# EAGLE design RTDS (EAGLE 9.4.0)
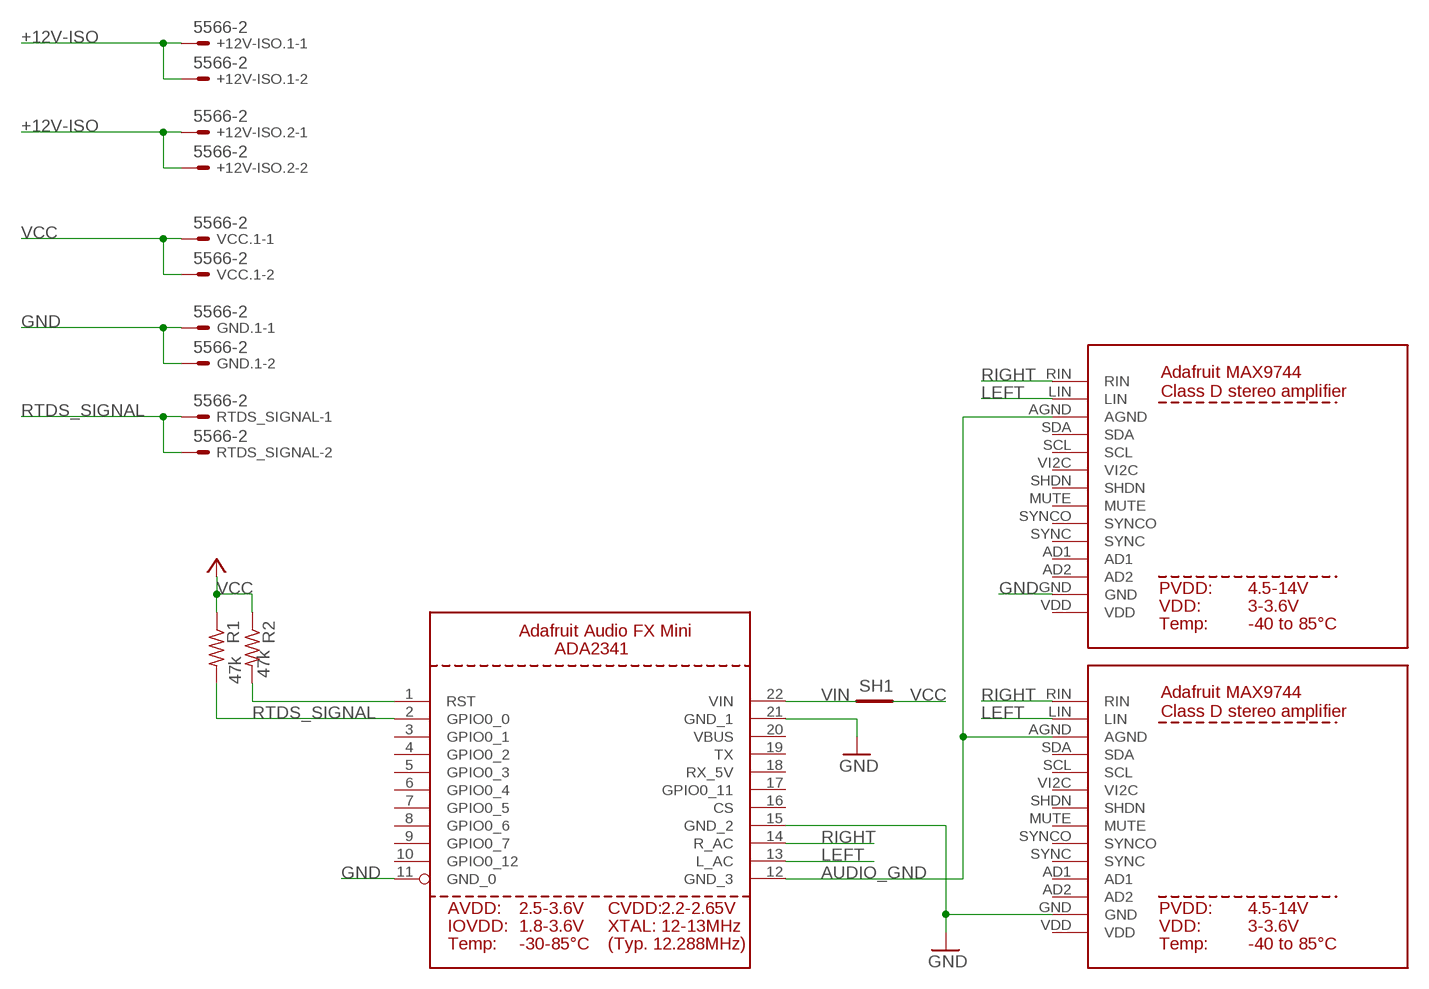
[diagram p0: schematic, sheet 1]

## Parts
+12V-ISO.1  5566-2  [5566-2]
+12V-ISO.2  5566-2  [5566-2]
GND.1  5566-2  [5566-2]
R1  47k  R-US_R0805  [R0805]
R2  47k  R-US_R0805  [R0805]
RTDS_SIGNAL  5566-2  [5566-2]
SH1  SHORTT5  [SHORT_TOP-50]
U$1  MAX9744  [MAX9744]
U$2  ADA-SOUNDFX  [ADA-SOUNDFX]
U$3  MAX9744  [MAX9744]
VCC.1  5566-2  [5566-2]

## Nets
+12V-ISO: +12V-ISO.1.1 +12V-ISO.1.2 +12V-ISO.2.1 +12V-ISO.2.2
AUDIO_GND: U$1.AGND U$2.12(GND_3) U$3.AGND
GND: GND.1.1 GND.1.2 U$1.GND U$2.11(GND_0) U$2.15(GND_2) U$2.21(GND_1) U$3.GND
LEFT: U$1.LIN U$2.13(L_AC) U$3.LIN
RESET_SIGNAL: R2.2 U$2.1(RST)
RIGHT: U$1.RIN U$2.14(R_AC) U$3.RIN
RTDS_SIGNAL: R1.2 RTDS_SIGNAL.1 RTDS_SIGNAL.2 U$2.2(GPIO0_0)
VCC: R1.1 R2.1 SH1.2 VCC.1.1 VCC.1.2
VIN: SH1.1 U$2.22(VIN)
Unconnected: U$1.AD1 U$1.AD2 U$1.MUTE U$1.SCL U$1.SDA U$1.SHDN U$1.SYNC U$1.SYNCO U$1.VDD U$1.VI2C U$2.3(GPIO0_1) U$2.4(GPIO0_2) U$2.5(GPIO0_3) U$2.6(GPIO0_4) U$2.7(GPIO0_5) U$2.8(GPIO0_6) U$2.9(GPIO0_7) U$2.10(GPIO0_12) U$2.16(CS) U$2.17(GPIO0_11) U$2.18(RX_5V) U$2.19(TX) U$2.20(VBUS) U$3.AD1 U$3.AD2 U$3.MUTE U$3.SCL U$3.SDA U$3.SHDN U$3.SYNC U$3.SYNCO U$3.VDD U$3.VI2C

## Library data of the parts
+12V-ISO.1 +12V-ISO.2 GND.1 RTDS_SIGNAL VCC.1 = con-molex:5566-2: Mini FIT connector 2 pol Source: http://www.molex.com; MF: MOLEX; OC_FARNELL: 1822072; OC_NEWARK: unknown
R1 R2 = rcl:R-US_: RESISTOR, American symbol; SPICEPREFIX: R
SH1 = shorts:SHORT: Short between two nets; BOM: no
U$1 U$3 = IowaFormula:MAX9744
U$2 = IowaFormula:ADA-SOUNDFX

## Board
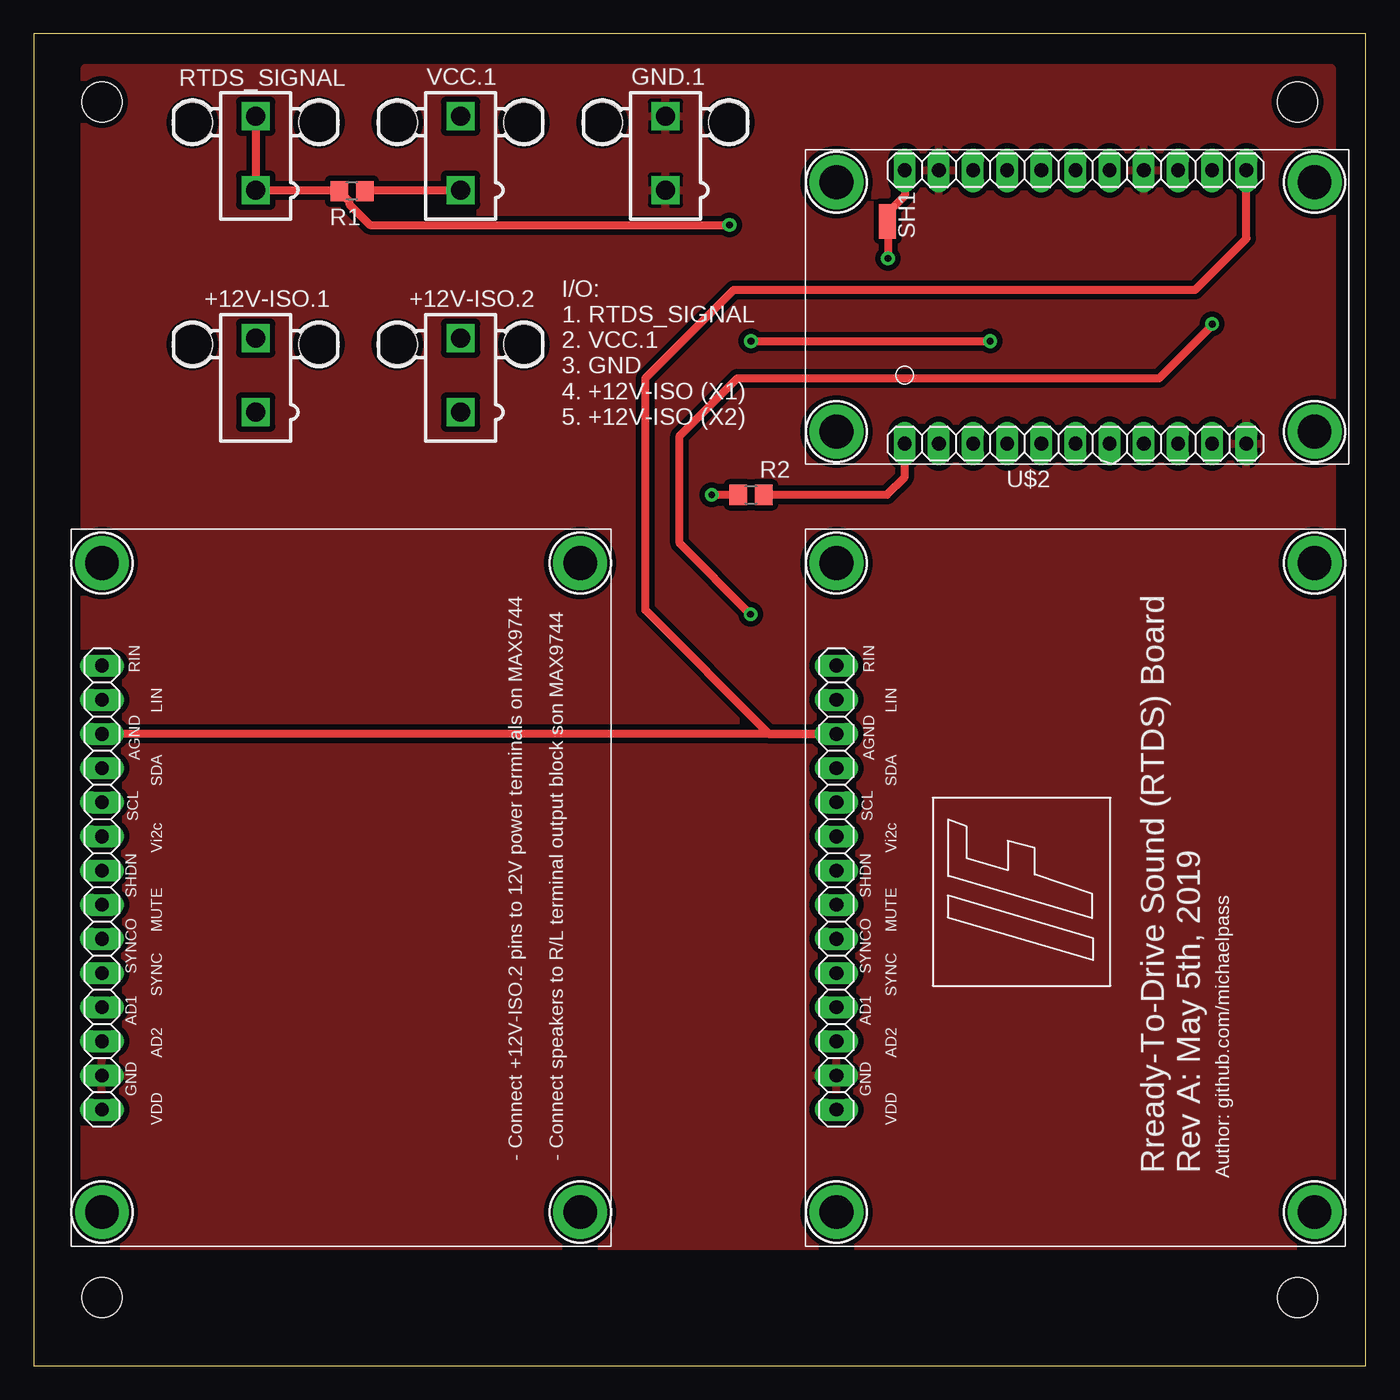
[diagram p1: board, top side]
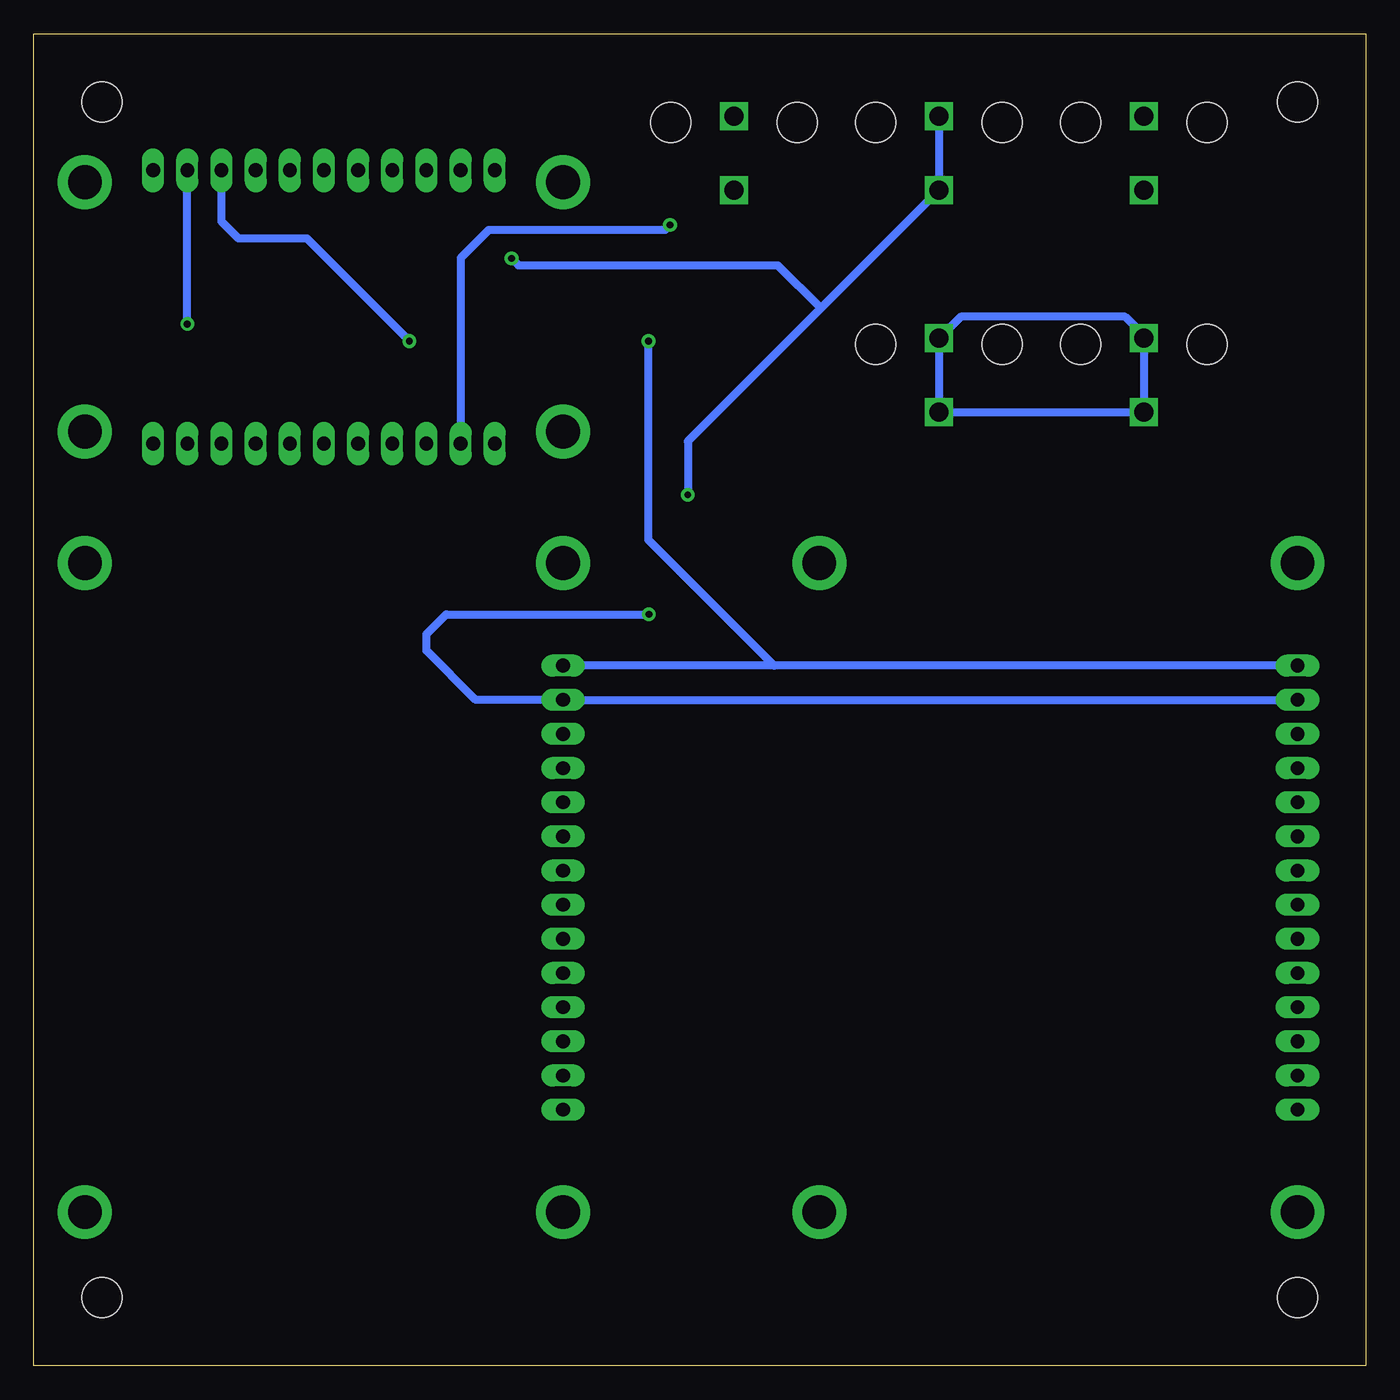
[diagram p2: board, bottom side, seen from below]

Size 99.06 x 99.06 mm. Coordinates in mm from the lower left corner, seen from the top.
Outline: 0,0 99.06,0 99.06,99.06 0,99.06 0,0
Copper layers (1*16): Top 0.035mm / dielectric 1.5mm / Bottom 0.035mm
Design rules "default *": minimum track width 8mil, minimum drill 20mil, track to track 8mil, track to pad 8mil, pad to pad 8mil, via to via 8mil, smd to smd 8mil, copper to edge 10mil, drill to drill 8mil, minimum pad ring 12mil, minimum via ring 10mil, stop-mask expansion 4mil, vias tented up to drill 25mil, thermal gap 10mil
Holes 3 mm at 5.08,5.08 93.98,5.08 5.08,93.98 93.98,93.98

### Footprints (pad centres in the part's own frame; a part is rotated, then mirrored left to right if it is on the bottom)
5566-2 = drill 1.4 square: 1 0,-2.75; 2 0,2.75 | hole 3: 4.7,2.29; -4.7,2.29
R0805 = smd 1.3 x 1.5: 1 -0.95,0; 2 0.95,0
SHORT_TOP-50 = smd 1.27 x 1.27: 1 0.635,0; 2 -0.635,0
MAX9744 = drill 1.016 long: AD1 33.02,0; AD2 35.56,0; AGND 12.7,0; GND 38.1,0; LIN 10.16,0; MUTE 25.4,0; RIN 7.62,0; SCL 17.78,0; SDA 15.24,0; SHDN 22.86,0; SYNC 30.48,0; SYNCO 27.94,0; VDD 40.64,0; VI2C 20.32,0 | drill 2.5 pad 4: P$1 0,0; P$2 48.26,0; P$3 0,35.56; P$4 48.26,35.56
ADA-SOUNDFX = drill 1.016 long: 1 0,25.4; 2 0,22.86; 3 0,20.32; 4 0,17.78; 5 0,15.24; 6 0,12.7; 7 0,10.16; 8 0,7.62; 9 0,5.08; 10 0,2.54; 11 0,0; 12 20.32,0; 13 20.32,2.54; 14 20.32,5.08; 15 20.32,7.62; 16 20.32,10.16; 17 20.32,12.7; 18 20.32,15.24; 19 20.32,17.78; 20 20.32,20.32; 21 20.32,22.86; 22 20.32,25.4 | drill 2.5 pad 4: P$1 0.889,30.48; P$2 19.431,30.48; P$3 0.889,-5.08; P$4 19.431,-5.08

### Placement (x,y rotation side)
+12V-ISO.1  16.51,73.66 0 top
+12V-ISO.2  31.75,73.66 0 top
GND.1  46.99,90.17 0 top
R1  23.67,87.35 180 top
R2  53.34,64.77 0 top
RTDS_SIGNAL  16.51,90.17 0 top
SH1  63.5,85.09 90 top
U$1  59.69,59.69 270 top
U$2  90.17,68.58 90 top
U$3  5.08,59.69 270 top
VCC.1  31.75,90.17 0 top

### Tracks (layer width: path | path; a pad name or v marks a point on that pad's centre or on a via)
+12V-ISO
  Bottom 0.61: +12V-ISO.1.2 +12V-ISO.1.1 +12V-ISO.2.1 +12V-ISO.2.2 31.71,76.41 30.11,78.01 17.89,78.01 16.51,76.62 +12V-ISO.1.2
AUDIO_GND
  Top 0.61: U$3.AGND U$1.AGND 59.66,46.96 54.72,46.96 45.49,56.2 45.49,73.43 52.07,80.01 86.36,80.01 90.17,83.82 U$2.12
GND
  pour Top (isolate 0.406): 3.81,96.52 96.52,96.52 96.52,8.89 3.81,8.89
LEFT  (via drill 0.51)
  Top 0.61: v53.31,55.88 48.03,61.16 48.03,69.14 52.32,73.43 83.69,73.43 87.68,77.42 v87.63,77.47
  Bottom 0.61: U$3.LIN U$1.LIN 66.19,49.53 69.85,53.19 69.85,54.41 68.38,55.88 v53.31,55.88 | v87.63,77.47 U$2.13
RESET_SIGNAL
  Top 0.61: R2.2 63.45,64.77 64.77,66.09 U$2.1
RIGHT  (via drill 0.51)
  Top 0.61: v53.34,76.2 v71.12,76.2
  Bottom 0.61: U$3.RIN 43.99,52.07 | 43.99,52.07 53.34,61.42 v53.34,76.2 | v71.12,76.2 78.74,83.82 83.82,83.82 85.09,85.09 U$2.14 | 43.99,52.07 U$1.RIN
RTDS_SIGNAL  (via drill 0.51)
  Top 0.61: RTDS_SIGNAL.2 RTDS_SIGNAL.1 22.65,87.42 R1.2 23.46,86.61 23.46,86.39 25.02,84.84 v51.74,84.84
  Bottom 0.61: v51.74,84.84 52.09,84.48 65.2,84.48 67.31,82.37 U$2.2
VCC  (via drill 0.51)
  Top 0.61: R1.1 24.69,87.42 VCC.1.1 | v50.42,64.77 R2.1 | v63.52,82.35 63.52,84.43 SH1.2
  Bottom 0.61: VCC.1.2 VCC.1.1 40.53,78.64 | 40.53,78.64 50.42,68.75 v50.42,64.77 | 40.53,78.64 43.74,81.84 63.02,81.84 v63.52,82.35
VIN
  Top 0.61: SH1.1 64.77,87 U$2.22

### Text on the board
tPlace: - Connect +12V-ISO.2 pins to 12V power terminals on MAX9744 / / - Connect speakers to R/L terminal output block son MAX9744
tNames: I/O: / 1. RTDS_SIGNAL / 2. VCC.1 / 3. GND / 4. +12V-ISO (X1) / 5. +12V-ISO (X2) | Rready-To-Drive Sound (RTDS) Board / Rev A: May 5th, 2019 | Author: github.com/michaelpass